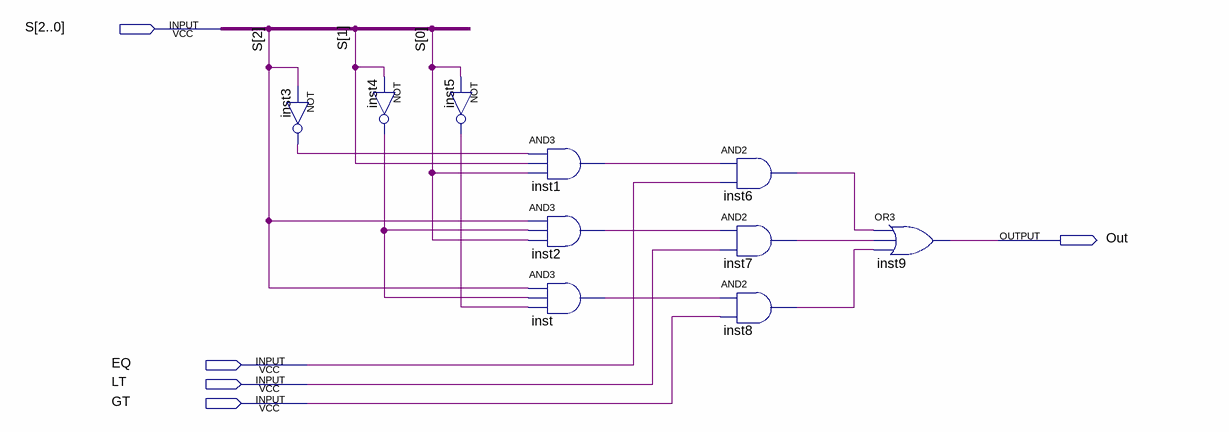
[diagram p0: schematic sheet]
// Quartus schematic status.bdf as structural Verilog: 10 symbols, 5 pins
module status (
  input  [2:0] S,
  input  EQ,
  input  LT,
  input  GT,
  output Out
);

  wire inst1_out, inst2_out, inst3_out, inst4_out, inst5_out, inst6_out, inst7_out, inst8_out, inst_out;

  not inst3 (inst3_out, S[2]);
  not inst4 (inst4_out, S[1]);
  not inst5 (inst5_out, S[0]);
  and inst1 (inst1_out, inst3_out, S[1], S[0]);
  and inst2 (inst2_out, S[2], inst4_out, S[0]);
  and inst (inst_out, S[2], inst4_out, inst5_out);
  and inst6 (inst6_out, inst1_out, EQ);
  and inst7 (inst7_out, inst2_out, LT);
  and inst8 (inst8_out, inst_out, GT);
  or inst9 (Out, inst6_out, inst7_out, inst8_out);
endmodule
